# Altium schematic sheet DAC.SchDoc
size 406 x 304 mm; SheetNumber: 5; SheetTotal: 8
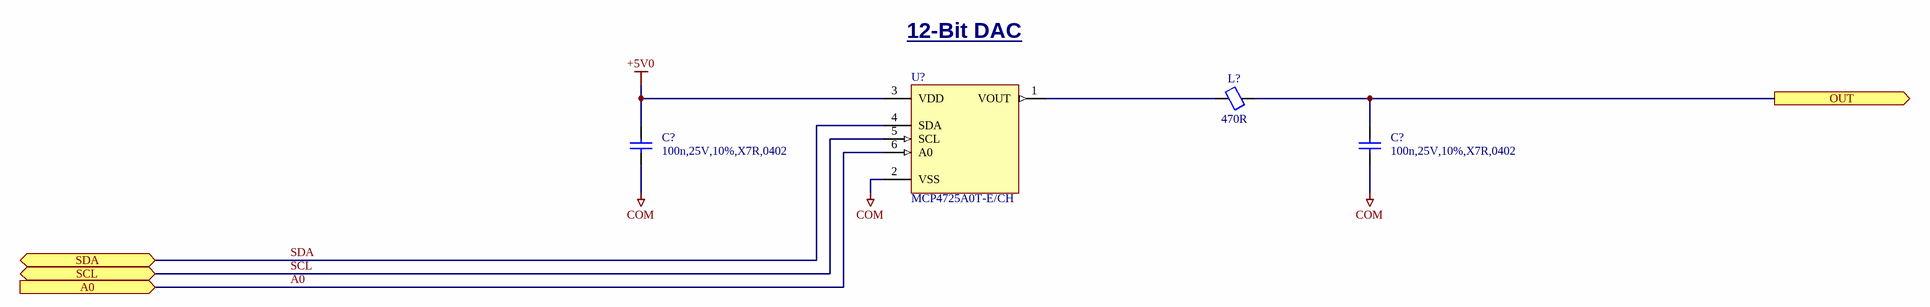
[diagram p0: DAC.SchDoc]

## Parts
(Parts that share a designator on the sheet are numbered #1, #2 ... from top to bottom, then left to right.)
C?#1  100n,25V,10%,X7R,0402  [CAPC1005X06N]
C?#2  100n,25V,10%,X7R,0402  [CAPC1005X06N]
L?  470R  [INDC1005X05N]
U?  MCP4725A0T-E/CH  [SOTFL95P260X145-6]

## Ports
A0 (in), OUT (out), SCL (bidir), SDA (bidir)

## Nets
+5V0: C?#1.2 U?.3(VDD)
COM: C?#1.1 C?#2.1 U?.2(VSS)
A0: U?.6(A0) ; port A0
OUT: C?#2.2 L?.1 ; port OUT
SCL: U?.5(SCL) ; port SCL
SDA: U?.4(SDA) ; port SDA
NetL?_2: L?.2 U?.1(VOUT)

## Notes on the sheet
- 12-Bit DAC
- Sheet Name:
- Date:
- Sheet
- Designer:
- of

## Library data of the parts
C?#1 C?#2 = CAP,Cer,100nF,10%,25VDC,X7R,0402: 0.1ï¿½F ï¿½10% 25V Ceramic Capacitor X7R 0402 (1005 Metric); Manufacturer 1: Murata Electronics; Manufacturer 1 Part Number: GRM155R71E104KE14J; Vendor 1 Part Number: 490-14603-1-ND; Vendor 1: DigiKey; Value: 100nF; Part Name: CAP,Cer,100nF,10%,25VDC,X7R,0402; CreatedBy: Judd Foster; HelpURL: https://search.murata.co.jp/Ceramy/image/img/A01X/G101/ENG/GRM155R71E104KE14-01.pdf
L? = Ferrite,470R@100MHz,0402: 470 Ohms @ 100 MHz 1 Power Line Ferrite Bead 0402 (1005 Metric) 1A 200mOhm; Manufacturer 1: Murata Electronics; Manufacturer 1 Part Number: BLM15PX471SN1D; Vendor 1 Part Number: 490-10662-1-ND; Vendor 1: Digikey; Part Name: Ferrite,470R@100MHz,0402; CreatedBy: Judd Foster; HelpURL: https://www.murata.com/en-us/products/productdata/8796740059166/ENFA0018.pdf; Value: 470R
U? = MCP4725A0T-E/CH: 6us 12 I2C 2.7V~5.5V SOT-23-6 Digital To Analog Converters (DACs) ROHS; Manufacturer 1: Microchip; Vendor 1 Part Number: C144198; Vendor 1: LCSC; Part Name: MCP4725A0T-E/CH; CreatedBy: Judd Foster; HelpURL: https://datasheet.lcsc.com/lcsc/1811151442_Microchip-Tech-MCP4725A0T-E-CH_C144198.pdf; Manufacturer 1 Part Number: MCP4725A0T-E/CH